# Altium project Control_Test_Board.PrjPcb
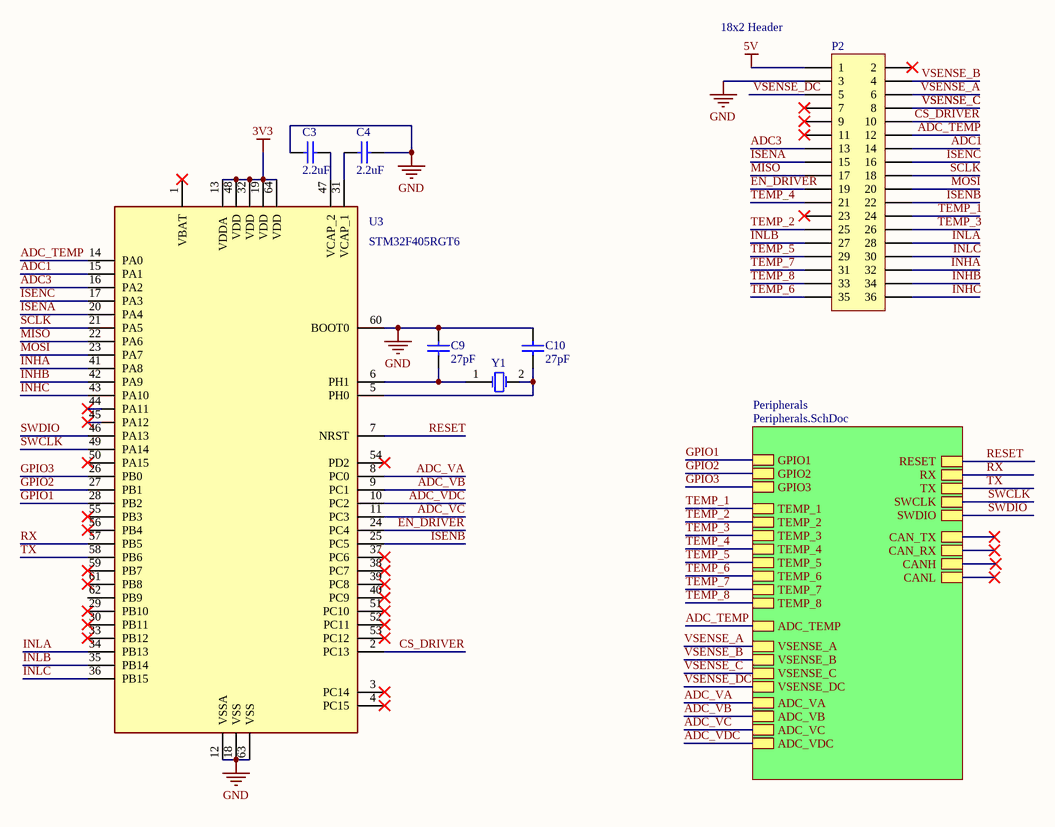
[diagram p0: Control_Test_Board.SchDoc]
2 sheets, 38 parts. Net scope: hierarchical (ports join the sheet entries above them; power ports are global).
Board file: Control_Test_Board.PcbDoc
Sheets:
  Control_Test_Board.SchDoc
    Peripherals = Peripherals.SchDoc

## Sheet Control_Test_Board.SchDoc: Control Test Board - Logic
size A4; Author: Dev Patel; Organization: Waterloop; Address1: 200 University Ave W; Address2: Engineering 5, 1104; Address3: Waterloo, ON; Address4: N2L 3G1; Revision: 1.0; SheetNumber: 1; SheetTotal: 2

### Parts
C3  value 2.2uF  [0805 - Capacitor]  (hidden comment: Capacitor - Nonpolarized)
C4  value 2.2uF  [0805 - Capacitor]  (hidden comment: Capacitor - Nonpolarized)
C9  value 27pF  [0805 - Capacitor]  (hidden comment: 100V)
C10  value 27pF  [0805 - Capacitor]  (hidden comment: 100V)
P2  Header 18X2  [HDR2X18]  (value not drawn)
U3  STM32F405RGT6  [STM32F405RG]
Y1  Oscillator  [2-SMD NO LEAD CRSYSTAL]  (value not drawn)

### Sub-sheets
Peripherals = Peripherals.SchDoc: GPIO1, GPIO2, GPIO3, TEMP_1, TEMP_2, TEMP_3, TEMP_4, TEMP_5, TEMP_6, TEMP_7, TEMP_8, ADC_TEMP, VSENSE_A, VSENSE_B, VSENSE_C, VSENSE_DC, ADC_VA, ADC_VB, ADC_VC, ADC_VDC, RESET, RX, TX, SWCLK, SWDIO, CAN_TX, CAN_RX, CANH, CANL

### Nets
3V3: U3.13(VDDA) U3.19(VDD) U3.32(VDD) U3.48(VDD) U3.64(VDD)
5V: P2.1
GND: C3.1 C4.2 C9.2 C10.2 P2.3 U3.12(VSSA) U3.18(VSS) U3.60(BOOT0) U3.63(VSS)
ADC1: P2.14 U3.15(PA1)
ADC3: P2.13 U3.16(PA2)
ADC_TEMP: P2.12 U3.14(PA0) ; sheet Peripherals/ADC_TEMP
ADC_VA: U3.8(PC0) ; sheet Peripherals/ADC_VA
ADC_VB: U3.9(PC1) ; sheet Peripherals/ADC_VB
ADC_VC: U3.11(PC3) ; sheet Peripherals/ADC_VC
ADC_VDC: U3.10(PC2) ; sheet Peripherals/ADC_VDC
CS_DRIVER: P2.10 U3.2(PC13)
EN_DRIVER: P2.19 U3.24(PC4)
GPIO1: U3.28(PB2) ; sheet Peripherals/GPIO1
GPIO2: U3.27(PB1) ; sheet Peripherals/GPIO2
GPIO3: U3.26(PB0) ; sheet Peripherals/GPIO3
INHA: P2.32 U3.41(PA8)
INHB: P2.34 U3.42(PA9)
INHC: P2.36 U3.43(PA10)
INLA: P2.28 U3.34(PB13)
INLB: P2.27 U3.35(PB14)
INLC: P2.30 U3.36(PB15)
ISENA: P2.15 U3.20(PA4)
ISENB: P2.22 U3.25(PC5)
ISENC: P2.16 U3.17(PA3)
MISO: P2.17 U3.22(PA6)
MOSI: P2.20 U3.23(PA7)
RESET: U3.7(NRST) ; sheet Peripherals/RESET
RX: U3.57(PB5) ; sheet Peripherals/RX
SCLK: P2.18 U3.21(PA5)
SWCLK: U3.49(PA14) ; sheet Peripherals/SWCLK
SWDIO: U3.46(PA13) ; sheet Peripherals/SWDIO
TEMP_1: P2.24 ; sheet Peripherals/TEMP_1
TEMP_2: P2.25 ; sheet Peripherals/TEMP_2
TEMP_3: P2.26 ; sheet Peripherals/TEMP_3
TEMP_4: P2.21 ; sheet Peripherals/TEMP_4
TEMP_5: P2.29 ; sheet Peripherals/TEMP_5
TEMP_6: P2.35 ; sheet Peripherals/TEMP_6
TEMP_7: P2.31 ; sheet Peripherals/TEMP_7
TEMP_8: P2.33 ; sheet Peripherals/TEMP_8
TX: U3.58(PB6) ; sheet Peripherals/TX
VSENSE_A: P2.6 ; sheet Peripherals/VSENSE_A
VSENSE_B: P2.4 ; sheet Peripherals/VSENSE_B
VSENSE_C: P2.8 ; sheet Peripherals/VSENSE_C
VSENSE_DC: P2.5 ; sheet Peripherals/VSENSE_DC
NetC3_2: C3.2 U3.47(VCAP_2)
NetC4_1: C4.1 U3.31(VCAP_1)
NetC9_1: C9.1 U3.6(PH1) Y1.1(OSC1)
NetC10_1: C10.1 U3.5(PH0) Y1.2(OSC2)

Not connected (* = marked no-connect by the designer): P2 2* 7* 9* 11* 23*; U3 1(VBAT)* 3(PC14)* 4(PC15)* 29(PB10)* 30(PB11)* 33(PB12)* 37(PC6)* 38(PC7)* 39(PC8)* 40(PC9)* 44(PA11)* 45(PA12)* 50(PA15)* 51(PC10)* 52(PC11)* 53(PC12)* 54(PD2)* 55(PB3)* 56(PB4)* 59(PB7)* 61(PB8)* 62(PB9)

### Notes on the sheet
- 18x2 Header
- Title:
- Size:
- Date:
- A4
- Author:
- Revision:
- Sheet
- of
- File:

### Library data of the parts
C3 C4 C9 C10 = Capacitor - Nonpolarized: Nonpolarized Capacitor; Supplier: *; Manufacturer: *; Rating: *; Manufacturer Part Number: *
  C3 C4: Supplier Part Number: 311-3420-1-ND
  C9 C10: Supplier Part Number: 311-1104-1-ND
P2 = Header 18X2: Header, 18-Pin, Dual row; LatestRevisionDate: 17-Jul-2002; LatestRevisionNote: Re-released for DXP Platform.; Publisher: Altium Limited
U3 = STM32F405RGT6: ST 64-pin Micro; Manufacturer Part Number: STM32F405RG; Manufacturer: ST; Supplier Part Number: 497-11767-ND; Supplier: Digikey; ComponentLink1Description: Datsheet; ComponentLink1URL: https://www.st.com/content/ccc/resource/technical/document/datasheet/ef/92/76/6d/bb/c2/4f/f7/DM00037051.pdf/files/DM00037051.pdf/jcr:content/translations/en.DM00037051.pdf
Y1 = Oscillator: Crystal Oscillator; Value: 16MHz; Manufacturer Part Number: *; Manufacturer: *; Supplier Part Number: 535-13460-1-ND; Supplier: *; Rating: *

## Sheet Peripherals.SchDoc
size A4; SheetNumber: 2; SheetTotal: 2
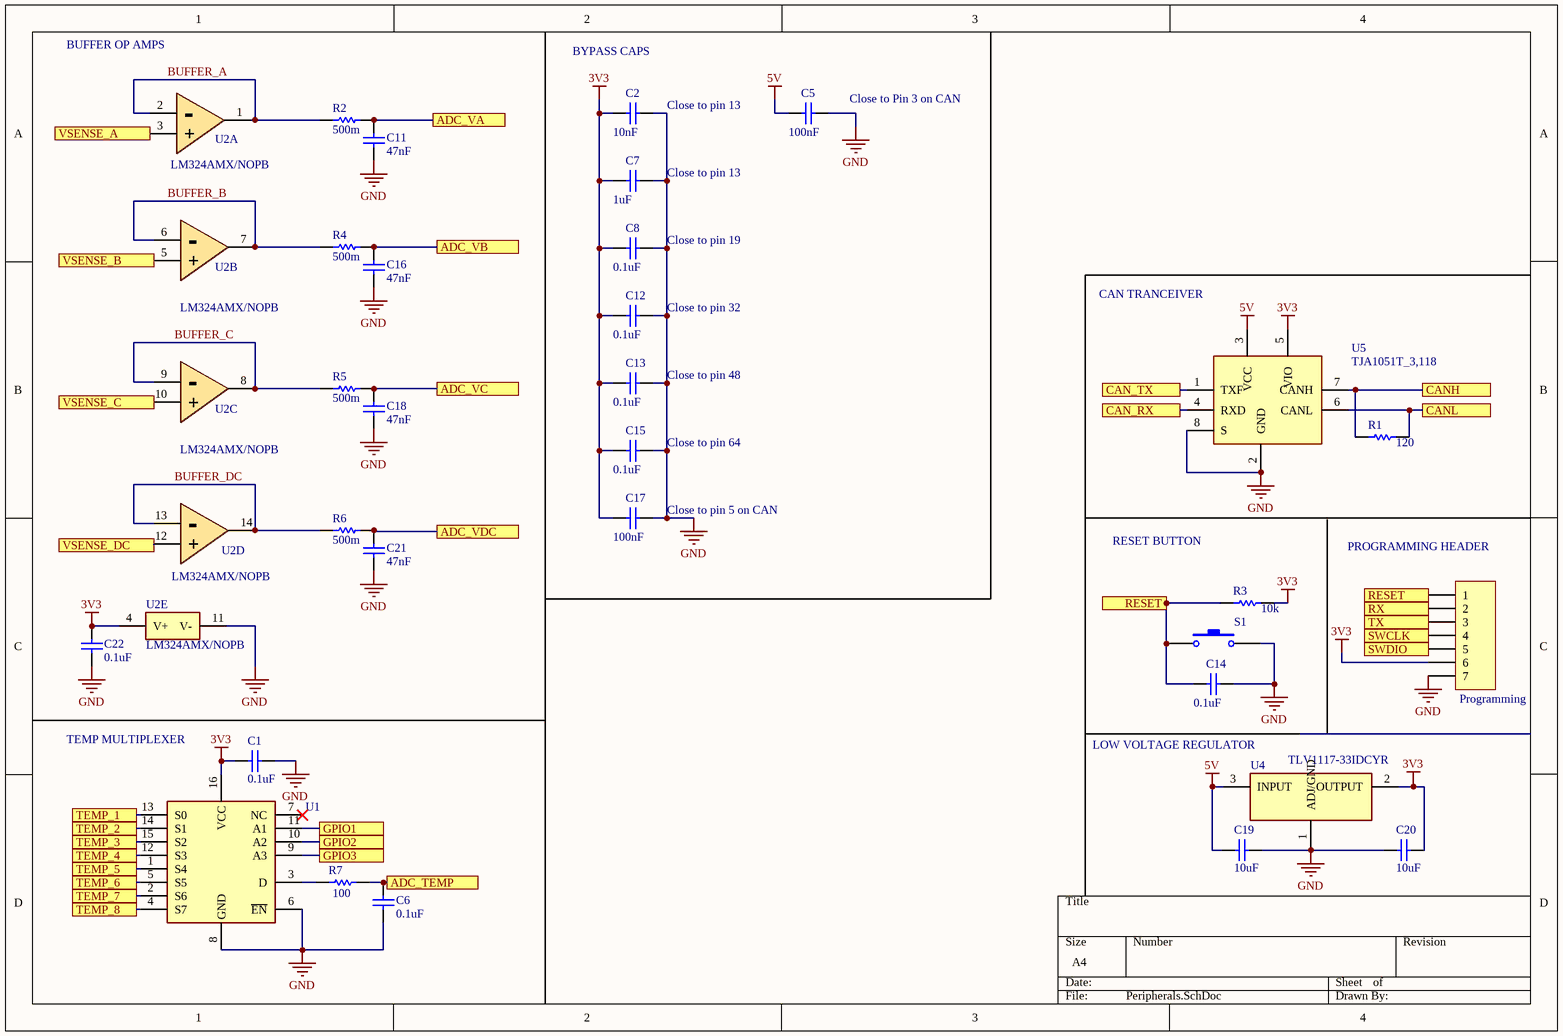
[diagram p1: Peripherals.SchDoc]

### Parts
C1  value 0.1uF  [0805 - Capacitor]  (hidden comment: Capacitor - Nonpolarized)
C2  value 10nF  [0805 - Capacitor]  (hidden comment: 10V)
C5  value 100nF  [0805 - Capacitor]  (hidden comment: Capacitor - Nonpolarized)
C6  value 0.1uF  [0805 - Capacitor]  (hidden comment: Capacitor - Nonpolarized)
C7  value 1uF  [0805 - Capacitor]  (hidden comment: 100V)
C8  value 0.1uF  [0805 - Capacitor]  (hidden comment: 100V)
C11  value 47nF  [0805 - Capacitor]  (hidden comment: Capacitor - Nonpolarized)
C12  value 0.1uF  [0805 - Capacitor]  (hidden comment: 100V)
C13  value 0.1uF  [0805 - Capacitor]  (hidden comment: 100V)
C14  value 0.1uF  [0805 - Capacitor]  (hidden comment: 100V)
C15  value 0.1uF  [0805 - Capacitor]  (hidden comment: 100V)
C16  value 47nF  [0805 - Capacitor]  (hidden comment: Capacitor - Nonpolarized)
C17  value 100nF  [0805 - Capacitor]  (hidden comment: Capacitor - Nonpolarized)
C18  value 47nF  [0805 - Capacitor]  (hidden comment: Capacitor - Nonpolarized)
C19  value 10uF  [0805 - Capacitor]  (hidden comment: Capacitor - Nonpolarized)
C20  value 10uF  [0805 - Capacitor]  (hidden comment: Capacitor - Nonpolarized)
C21  value 47nF  [0805 - Capacitor]  (hidden comment: Capacitor - Nonpolarized)
C22  value 0.1uF  [0805 - Capacitor]  (hidden comment: Capacitor - Nonpolarized)
Programming  Programming  [HDR1X7]  (value not drawn)
R1  value 120  [0603 - Resistor]  (hidden comment: 10k)
R2  value 500m  [0603 - Resistor]  (hidden comment: Resistor)
R3  10k  [0603 - Resistor]
R4  value 500m  [0603 - Resistor]  (hidden comment: Resistor)
R5  value 500m  [0603 - Resistor]  (hidden comment: Resistor)
R6  value 500m  [0603 - Resistor]  (hidden comment: Resistor)
R7  value 100  [0603 - Resistor]  (hidden comment: Resistor)
S1  Switch - Push Button  [6x6mm Switch]  (value not drawn)
U1  NX3L4051PW,118  [SOP65P640X120-16N]  (value not drawn)
U2  LM324AMX/NOPB  [LM324AMX/NOPB]  (parts A,B,C,D,E of 5)
U4  TLV1117-33IDCYR  [TLV1117]
U5  TJA1051T_3,118  [TJA1051T/3,118]

### Ports
ADC_TEMP, ADC_VA, ADC_VB, ADC_VC, ADC_VDC, CAN_RX, CAN_TX, CANH, CANL, GPIO1, GPIO2, GPIO3, RESET, RX, SWCLK, SWDIO, TEMP_1, TEMP_2, TEMP_3, TEMP_4, TEMP_5, TEMP_6, TEMP_7, TEMP_8, TX, VSENSE_A, VSENSE_B, VSENSE_C, VSENSE_DC

### Nets
3V3: C1.1 C2.1 C7.1 C8.1 C12.1 C13.1 C15.1 C17.2 C20.2 C22.1 Programming.6 R3.1 U1.16(VCC) U2.4(V+) U4.2(OUTPUT) U5.5(VIO)
5V: C5.2 C19.2 U4.3(INPUT) U5.3(VCC)
GND: C1.2 C2.2 C5.1 C6.1 C7.2 C8.2 C11.1 C12.2 C13.2 C14.2 C15.2 C16.1 C17.1 C18.1 C19.1 C20.1 C21.1 C22.2 Programming.7 S1.2 U1.6(~{EN}) U1.8(GND) U2.11(V-) U4.1(ADJ/GND) U5.2(GND) U5.8(S)
ADC_TEMP: C6.2 R7.1 ; port ADC_TEMP
ADC_VA: C11.2 R2.2 ; port ADC_VA
ADC_VB: C16.2 R4.2 ; port ADC_VB
ADC_VC: C18.2 R5.2 ; port ADC_VC
ADC_VDC: C21.2 R6.2 ; port ADC_VDC
BUFFER_A: R2.1 U2.1 U2.2(-)
BUFFER_B: R4.1 U2.6(-) U2.7
BUFFER_C: R5.1 U2.8 U2.9(-)
BUFFER_DC: R6.1 U2.13(-) U2.14
GPIO1: U1.11(A1) ; port GPIO1
GPIO2: U1.10(A2) ; port GPIO2
GPIO3: U1.9(A3) ; port GPIO3
RESET: C14.1 Programming.1 R3.2 S1.1 ; port RESET
RX: Programming.2 ; port RX
SWCLK: Programming.4 ; port SWCLK
SWDIO: Programming.5 ; port SWDIO
TEMP_1: U1.13(S0) ; port TEMP_1
TEMP_2: U1.14(S1) ; port TEMP_2
TEMP_3: U1.15(S2) ; port TEMP_3
TEMP_4: U1.12(S3) ; port TEMP_4
TEMP_5: U1.1(S4) ; port TEMP_5
TEMP_6: U1.5(S5) ; port TEMP_6
TEMP_7: U1.2(S6) ; port TEMP_7
TEMP_8: U1.4(S7) ; port TEMP_8
TX: Programming.3 ; port TX
VSENSE_A: U2.3(+) ; port VSENSE_A
VSENSE_B: U2.5(+) ; port VSENSE_B
VSENSE_C: U2.10(+) ; port VSENSE_C
VSENSE_DC: U2.12(+) ; port VSENSE_DC
NetR1_1: R1.1 U5.6(CANL) ; port CANL
NetR1_2: R1.2 U5.7(CANH) ; port CANH
NetR7_2: R7.2 U1.3(D)
NetU5_1: U5.1(TXF) ; port CAN_TX
NetU5_4: U5.4(RXD) ; port CAN_RX

Not connected (* = marked no-connect by the designer): U1 7(NC)*

### Notes on the sheet
- BUFFER OP AMPS
- BYPASS CAPS
- Close to pin 13
- (near C5) Close to Pin 3 on CAN
- (near C7) Close to pin 13
- (near C8) Close to pin 19
- (near C12) Close to pin 32
- CAN TRANCEIVER
- (near C13) Close to pin 48
- (near C15) Close to pin 64
- (near C17) Close to pin 5 on CAN
- RESET BUTTON
- (near Programming) PROGRAMMING HEADER
- TEMP MULTIPLEXER
- LOW VOLTAGE REGULATOR

### Library data of the parts
C1 C2 C5-C8 C11-C22 = Capacitor - Nonpolarized: Nonpolarized Capacitor; Supplier: *; Manufacturer: *; Rating: *; Manufacturer Part Number: *
  C1 C6 C8 C12-C15 C22: Supplier Part Number: 311-1141-1-ND
  C2: Supplier Part Number: 311-1475-1-ND
  C5 C17: Supplier Part Number: 311-3420-1-ND
  C7: Supplier Part Number: 311-1456-1-ND
  C11 C16 C18 C21: Supplier Part Number: 311-1431-1-ND
  C19 C20: Supplier Part Number: 13-CC0805KFX7R6BB106CT-ND
Programming = 1x7 Header: 1x7 Pin Header
R1 R3 = Resistor: Rating: *; Manufacturer Part Number: *; Manufacturer: *; Supplier Part Number: 311-10.0KHRCT-ND; Supplier: *
  R3: Value: 10k
S1 = Switch - Push Button: Push Button Switch; Supplier: *; Manufacturer Part Number: *; Manufacturer: *; Supplier Part Number: *; Rating: *; Value: *
U1 = NX3L4051PW,118: 8:1 MUX; Manufacturer: NXP; Manufacturer Part Number: NX3L4051PW,118; Supplier Part Number: 568-12393-1-ND; Supplier: Digikey; ComponentLink1Description: Datsheet; ComponentLink1URL: https://www.nxp.com/docs/en/data-sheet/NX3L4051.pdf
U2 = LM324AMX/NOPB: Gen Purp 4Ch Opamp; Manufacturer: TI; Manufacturer Part Number: LM324AMX/NOPB; Supplier Part Number: LM324AMX/NOPBCT-ND; Supplier: Digikey; ComponentLink1Description: Datasheet; ComponentLink1URL: https://www.ti.com/lit/ds/symlink/lm124-n.pdf?HQS=dis-dk-null-digikeymode-dsf-pf-null-wwe&ts=1616555832552
U4 = TLV1117-33IDCYR: Linear Voltage Regulator IC 3.3V 800MA SOT223-4; Manufacturer: Texas Instruments; Manufacturer Part Number: TLV1117-33IDCYR; Supplier Part Number: 296-21112-1-ND; Supplier: Digikey; ComponentLink1Description: Datasheet; ComponentLink1URL: http://www.ti.com/lit/ds/symlink/tlv1117.pdf?HQS=TI-null-null-digikeymode-df-pf-null-wwe&ts=1590668900314
U5 = TJA1051T_3,118: CAN Transceiver IC 4.5V-5.5V 250ns; Manufacturer: NXP; Manufacturer Part Number: TJA1051T/3,118; Supplier Part Number: 568-8684-1-ND; Supplier: Digikey; ComponentLink1Description: Datasheet; ComponentLink1URL: http://www.nxp.com/docs/en/data-sheet/TJA1051.pdf
R2 R4-R7 = Resistor: Rating: *; Manufacturer Part Number: *; Manufacturer: *; Supplier: *
  R2 R4-R6: Supplier Part Number: 13-RL0603JR-070R5LCT-ND
  R7: Supplier Part Number: 311-100HRCT-ND

## Nets that join several sheets
3V3: Control_Test_Board (5 pins), Peripherals (16 pins)
5V: Control_Test_Board (P2.1), Peripherals (C5.2 C19.2 U4.3 U5.3)
GND: Control_Test_Board (9 pins), Peripherals (26 pins)
ADC_TEMP: Control_Test_Board (P2.12 U3.14), Peripherals (C6.2 R7.1)
ADC_VA: Control_Test_Board (U3.8), Peripherals (C11.2 R2.2)
ADC_VB: Control_Test_Board (U3.9), Peripherals (C16.2 R4.2)
ADC_VC: Control_Test_Board (U3.11), Peripherals (C18.2 R5.2)
ADC_VDC: Control_Test_Board (U3.10), Peripherals (C21.2 R6.2)
GPIO1: Control_Test_Board (U3.28), Peripherals (U1.11)
GPIO2: Control_Test_Board (U3.27), Peripherals (U1.10)
GPIO3: Control_Test_Board (U3.26), Peripherals (U1.9)
RESET: Control_Test_Board (U3.7), Peripherals (C14.1 Programming.1 R3.2 S1.1)
RX: Control_Test_Board (U3.57), Peripherals (Programming.2)
SWCLK: Control_Test_Board (U3.49), Peripherals (Programming.4)
SWDIO: Control_Test_Board (U3.46), Peripherals (Programming.5)
TEMP_1: Control_Test_Board (P2.24), Peripherals (U1.13)
TEMP_2: Control_Test_Board (P2.25), Peripherals (U1.14)
TEMP_3: Control_Test_Board (P2.26), Peripherals (U1.15)
TEMP_4: Control_Test_Board (P2.21), Peripherals (U1.12)
TEMP_5: Control_Test_Board (P2.29), Peripherals (U1.1)
TEMP_6: Control_Test_Board (P2.35), Peripherals (U1.5)
TEMP_7: Control_Test_Board (P2.31), Peripherals (U1.2)
TEMP_8: Control_Test_Board (P2.33), Peripherals (U1.4)
TX: Control_Test_Board (U3.58), Peripherals (Programming.3)
VSENSE_A: Control_Test_Board (P2.6), Peripherals (U2.3)
VSENSE_B: Control_Test_Board (P2.4), Peripherals (U2.5)
VSENSE_C: Control_Test_Board (P2.8), Peripherals (U2.10)
VSENSE_DC: Control_Test_Board (P2.5), Peripherals (U2.12)